# EAGLE schematic AncientFilter (EAGLE 7.7.0)

## Sheet 1 of 2
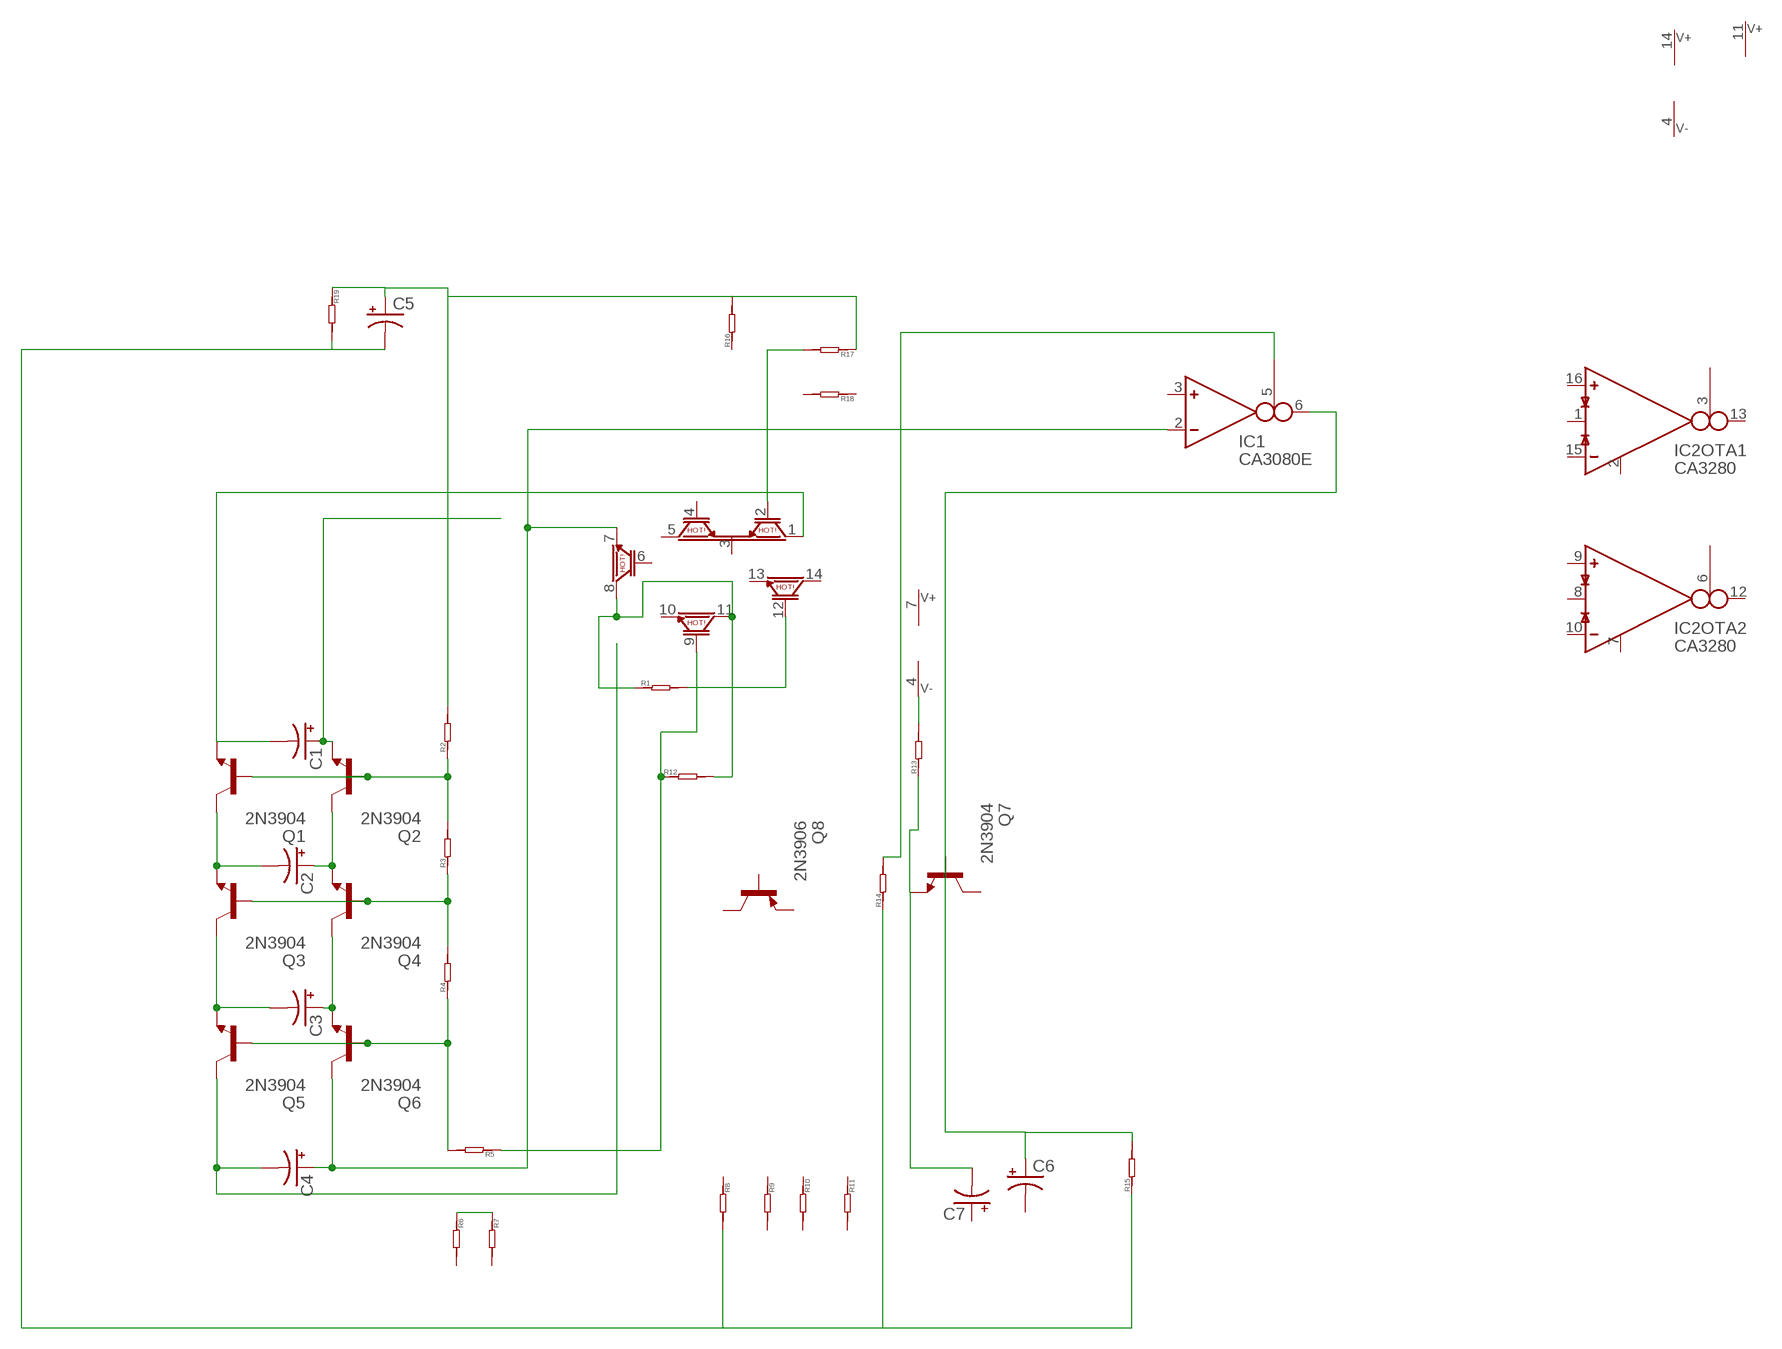
[diagram p0: schematic, sheet 1]

### Parts
C1  CPOL-USB45181A  [B45181A]
C2  CPOL-USB45181A  [B45181A]
C3  CPOL-USB45181A  [B45181A]
C4  CPOL-USB45181A  [B45181A]
C5  CPOL-USB45181A  [B45181A]
C6  CPOL-USB45181A  [B45181A]
C7  CPOL-USB45181A  [B45181A]
IC1  CA3080E  [DIL08]
IC2  CA3280  [SO16]
Q1  2N3904  [TO92]
Q2  2N3904  [TO92]
Q3  2N3904  [TO92]
Q4  2N3904  [TO92]
Q5  2N3904  [TO92]
Q6  2N3904  [TO92]
Q7  2N3904  [TO92]
Q8  2N3906  [TO92]
R1  R-0603  [R0603]
R2  R-0603  [R0603]
R3  R-0603  [R0603]
R4  R-0603  [R0603]
R5  R-0603  [R0603]
R6  R-0603  [R0603]
R7  R-0603  [R0603]
R8  R-0603  [R0603]
R9  R-0603  [R0603]
R10  R-0603  [R0603]
R11  R-0603  [R0603]
R12  R-0603  [R0603]
R13  R-0603  [R0603]
R14  R-0603  [R0603]
R15  R-0603  [R0603]
R16  R-0603  [R0603]
R17  R-0603  [R0603]
R18  R-0603  [R0603]
R19  R-0603  [R0603]
U$1  LM3046  [SO14]

### Nets
N$2: Q1.2(B) Q2.2(B) R2.1 R3.2
N$3: C1.+ Q2.3(E)
N$4: Q3.2(B) Q4.2(B) R3.1 R4.2
N$5: Q5.2(B) Q6.2(B) R4.1 R5.2
N$6: C1.- Q1.3(E) U$1.1(C2)
N$7: R6.1 R7.1
N$8: C2.- Q1.1(C) Q3.3(E)
N$9: C3.- Q3.1(C) Q5.3(E)
N$10: C2.+ Q2.1(C) Q4.3(E)
N$11: C3.+ Q4.1(C) Q6.3(E)
N$12: C4.- Q5.1(C)
N$13: C4.+ IC1.2(IN_N) Q6.1(C) U$1.7(E)
N$14: R5.1 R12.1 U$1.9(B)
N$15: R17.2 U$1.2(B2)
N$16: R1.2 U$1.12(B)
N$18: C5.+ R2.2 R16.2 R17.1 R19.1
N$19: C5.- R8.2 R14.1 R15.1 R19.2
N$20: IC1.5(I_BIAS) R14.2
N$21: C6.+ IC1.6(OUT) Q7.2(B) R15.2
N$22: C7.- Q7.3(E) R13.1
N$23: IC1.4(V-) R13.2
N$24: R1.1 R12.2 U$1.8(C) U$1.11(C)
Unconnected: C6.- C7.+ IC1.3(IN_P) IC1.7(V+) IC2.1(OTA1:I_DIODE) IC2.2(OTA1:NODE_X) IC2.3(OTA1:I_BIAS) IC2.4(SUPPLY1:V-) IC2.6(OTA2:I_BIAS) IC2.7(OTA2:NODE_X) IC2.8(OTA2:I_DIODE) IC2.9(OTA2:IN_P) IC2.10(OTA2:IN_N) IC2.11(SUPPLY2:V+) IC2.12(OTA2:OUT) IC2.13(OTA1:OUT) IC2.14(SUPPLY1:V+) IC2.15(OTA1:IN_N) IC2.16(OTA1:IN_P) Q7.1(C) Q8.1(C) Q8.2(B) Q8.3(E) R6.2 R7.2 R8.1 R9.1 R9.2 R10.1 R10.2 R11.1 R11.2 R16.1 R18.1 R18.2 U$1.3(E) U$1.4(B1) U$1.5(C1) U$1.6(B) U$1.10(E) U$1.13(E) U$1.14(C)

## Sheet 2 of 2
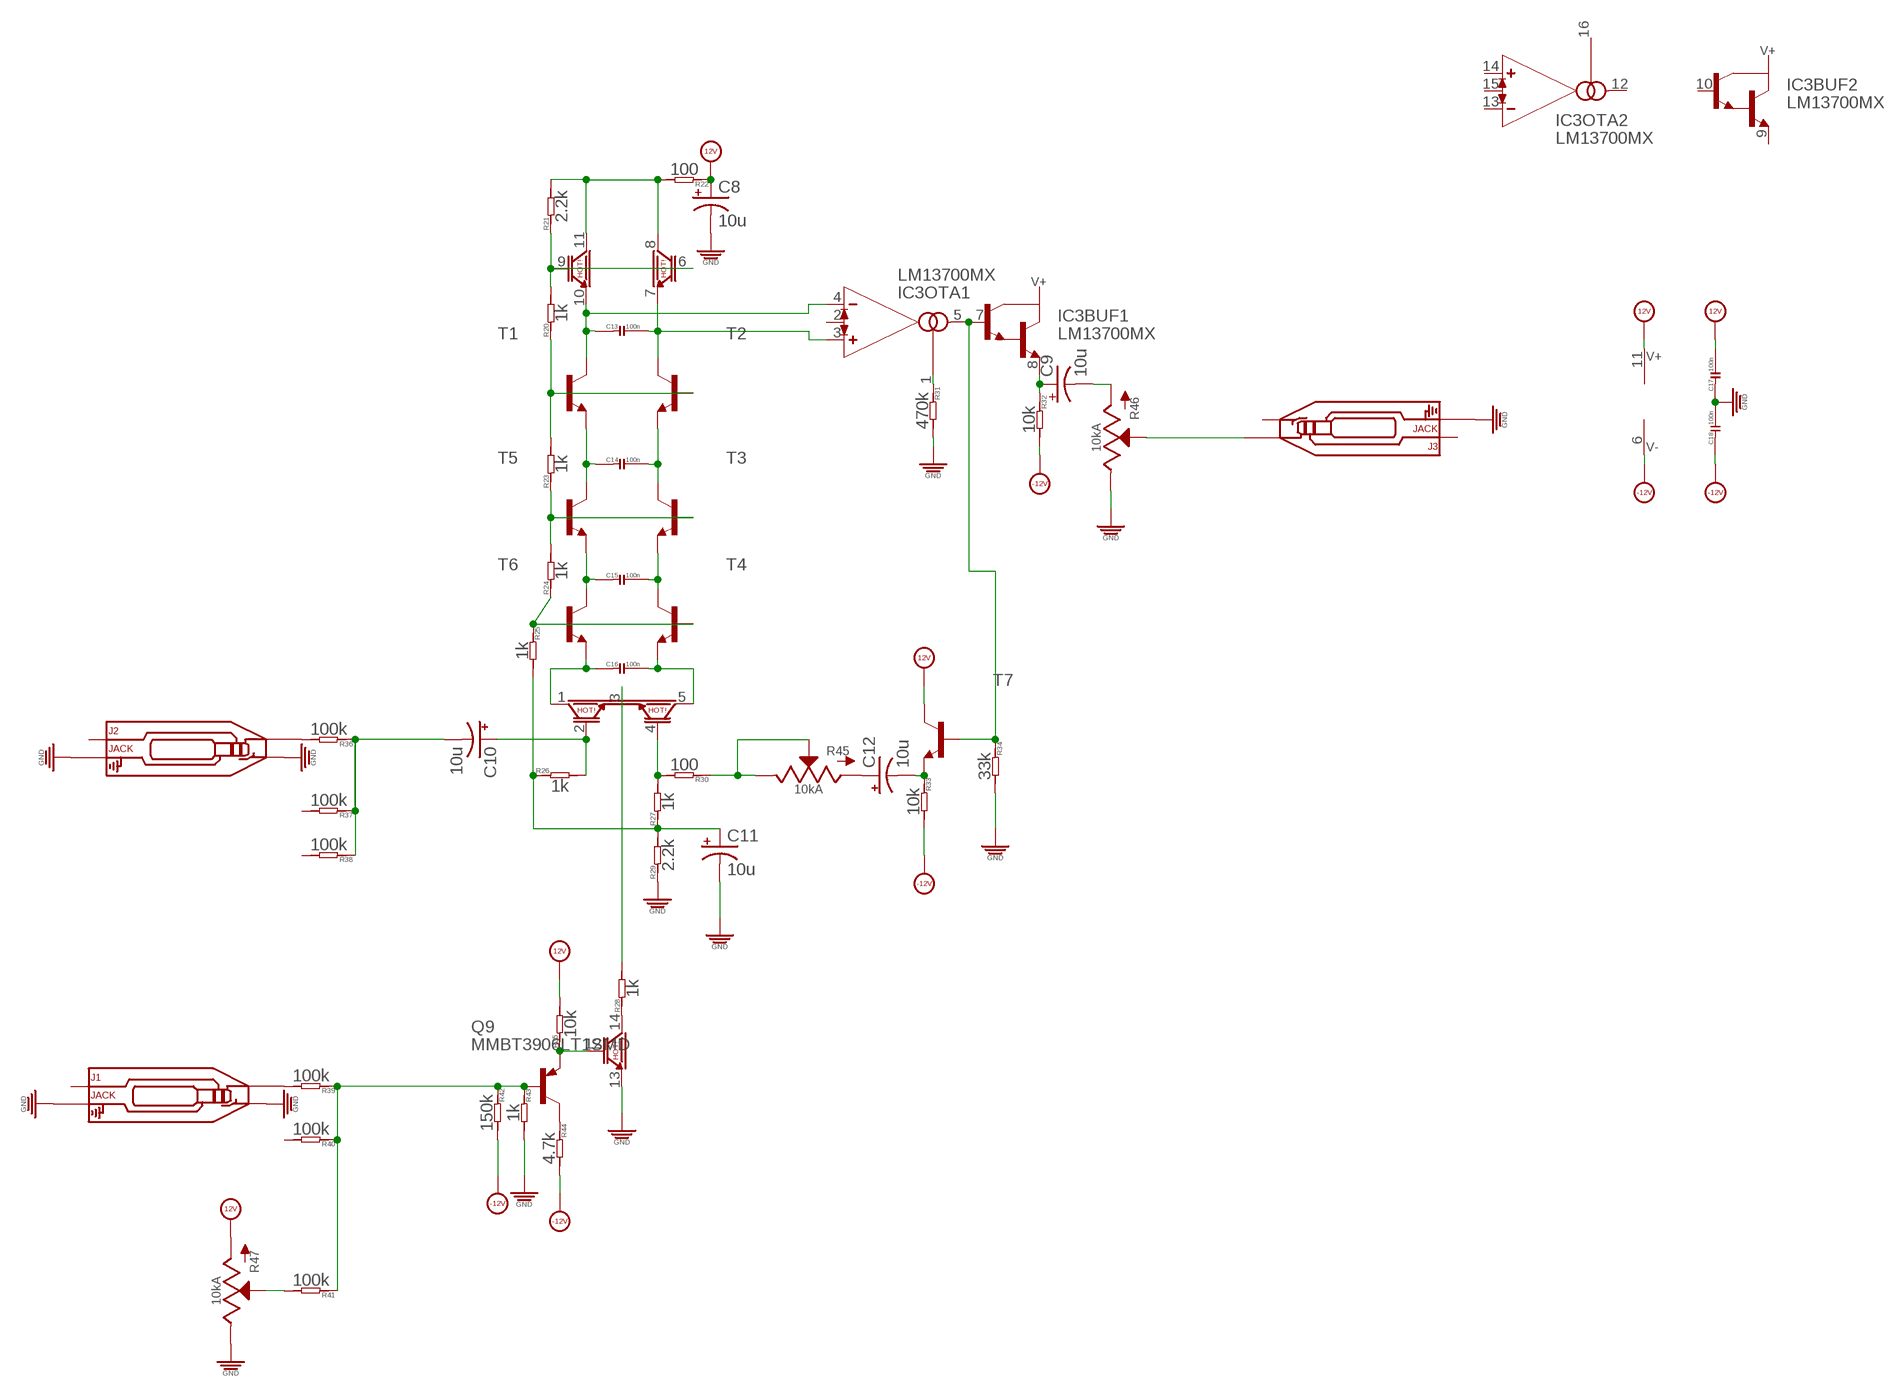
[diagram p1: schematic, sheet 2]

### Parts
C8  10u  CPOL-US153CLV-0605  [153CLV-0605]
C9  10u  CPOL-US153CLV-0605  [153CLV-0605]
C10  10u  CPOL-US153CLV-0605  [153CLV-0605]
C11  10u  CPOL-US153CLV-0605  [153CLV-0605]
C12  10u  CPOL-US153CLV-0605  [153CLV-0605]
C13  100n  C-0603  [C0603]
C14  100n  C-0603  [C0603]
C15  100n  C-0603  [C0603]
C16  100n  C-0603  [C0603]
C17  100n  C-0603  [C0603]
C18  100n  C-0603  [C0603]
IC3  LM13700MX  [SO16]
J1  JACK  AUDIO-JACK_SMALLSYMBOLNODRILL  [3.5MM-JACK-SWITCH-13MM-NOHOLES]
J2  JACK  AUDIO-JACK_SMALLSYMBOLNODRILL  [3.5MM-JACK-SWITCH-13MM-NOHOLES]
J3  JACK  AUDIO-JACK_SMALLSYMBOLNODRILL  [3.5MM-JACK-SWITCH-13MM-NOHOLES]
Q9  MMBT3906LT1SMD  [SOT23-BEC]
R20  1k  R-0603  [R0603]
R21  2.2k  R-0603  [R0603]
R22  100  R-0603  [R0603]
R23  1k  R-0603  [R0603]
R24  1k  R-0603  [R0603]
R25  1k  R-0603  [R0603]
R26  1k  R-0603  [R0603]
R27  1k  R-0603  [R0603]
R28  1k  R-0603  [R0603]
R29  2.2k  R-0603  [R0603]
R30  100  R-0603  [R0603]
R31  470k  R-0603  [R0603]
R32  10k  R-0603  [R0603]
R33  10k  R-0603  [R0603]
R34  33k  R-0603  [R0603]
R35  10k  R-0603  [R0603]
R36  100k  R-0603  [R0603]
R37  100k  R-0603  [R0603]
R38  100k  R-0603  [R0603]
R39  100k  R-0603  [R0603]
R40  100k  R-0603  [R0603]
R41  100k  R-0603  [R0603]
R42  150k  R-0603  [R0603]
R43  1k  R-0603  [R0603]
R44  4.7k  R-0603  [R0603]
R45  10kA  POTSQUAREHOLE_SMALLKNOB  [ALPS_POT_SQUAREHOLES]
R46  10kA  POTSQUAREHOLE_SMALLKNOB  [ALPS_POT_SQUAREHOLES]
R47  10kA  POTSQUAREHOLE_SMALLKNOB  [ALPS_POT_SQUAREHOLES]
T1  MMBT3904LT1-NPN-SOT23-BEC  [SOT23-BEC]
T2  MMBT3904LT1-NPN-SOT23-BEC  [SOT23-BEC]
T3  MMBT3904LT1-NPN-SOT23-BEC  [SOT23-BEC]
T4  MMBT3904LT1-NPN-SOT23-BEC  [SOT23-BEC]
T5  MMBT3904LT1-NPN-SOT23-BEC  [SOT23-BEC]
T6  MMBT3904LT1-NPN-SOT23-BEC  [SOT23-BEC]
T7  MMBT3904LT1-NPN-SOT23-BEC  [SOT23-BEC]
U$2  LM3046  [SO14]

### Nets
12V: C8.+ C17.2 IC3.11(SUPPLY:V+) R22.1 R35.2 R47.P$3(A) T7.C
-12V: C18.1 IC3.6(SUPPLY:V-) R32.2 R33.2 R42.2 R44.2
GND: C8.- C11.- C17.1 C18.2 J1.RING_B@1(RING) J1.RING_T@3(RING) J1.SWITCH_B@1(SWITCH) J1.SWITCH_T@3(SWITCH) J2.RING_B@1(RING) J2.RING_T@3(RING) J2.SWITCH_B@1(SWITCH) J2.SWITCH_T@3(SWITCH) J3.RING_B@1(RING) J3.RING_T@3(RING) R29.1 R31.2 R34.2 R43.2 R46.P$1(E) R47.P$1(E) U$2.13(E)
N$1: Q9.E R35.1 U$2.12(B)
N$17: C12.- R33.1 T7.E
N$26: R41.2 R47.P$2(S)
N$27: R20.2 R21.1 U$2.6(B) U$2.9(B)
N$28: C13.1 IC3.4(OTA1:IN_N) T1.C U$2.10(E)
N$29: C13.2 IC3.3(OTA1:IN_P) T2.C U$2.7(E)
N$30: C14.1 T1.E T5.C
N$31: C14.2 T2.E T3.C
N$32: C15.1 T5.E T6.C
N$33: C15.2 T3.E T4.C
N$34: C16.2 T4.E U$2.5(C1)
N$35: C16.1 T6.E U$2.1(C2)
N$36: R20.1 R23.2 T1.B T2.B
N$37: R23.1 R24.2 T3.B T5.B
N$38: R24.1 R25.1 T4.B T6.B
N$39: C10.+ R26.2 U$2.2(B2)
N$40: R28.2 U$2.3(E)
N$41: R28.1 U$2.14(C)
N$42: Q9.C R44.1
N$43: Q9.B R39.1 R40.1 R41.1 R42.1 R43.1
N$44: C10.- R36.1 R37.1 R38.1
N$45: C11.+ R25.2 R26.1 R27.1 R29.2
N$46: R27.2 R30.2 U$2.4(B1)
N$47: R21.2 R22.2 U$2.8(C) U$2.11(C)
N$49: IC3.1(OTA1:I_BIAS) R31.1
N$50: C9.- R46.P$3(A)
N$51: IC3.5(OTA1:OUT) IC3.7(BUF1:B) R34.1 T7.B
N$52: C9.+ IC3.8(BUF1:E) R32.1
N$53: J3.TIP_B@1(TIP) J3.TIP_T@3(TIP) R46.P$2(S)
N$54: R30.1 R45.P$1(E) R45.P$2(S)
N$55: C12.+ R45.P$3(A)
N$56: J1.TIP_B@1(TIP) J1.TIP_T@3(TIP) R39.2
N$57: J2.TIP_B@1(TIP) J2.TIP_T@3(TIP) R36.2
Unconnected: IC3.2(OTA1:I_DIODE) IC3.9(BUF2:E) IC3.10(BUF2:B) IC3.12(OTA2:OUT) IC3.13(OTA2:IN_N) IC3.14(OTA2:IN_P) IC3.15(OTA2:I_DIODE) IC3.16(OTA2:I_BIAS) J1.SECOND_B@1(SECOND) J1.SECOND_T@3(SECOND) J2.SECOND_B@1(SECOND) J2.SECOND_T@3(SECOND) J3.SECOND_B@1(SECOND) J3.SECOND_T@3(SECOND) J3.SWITCH_B@1(SWITCH) J3.SWITCH_T@3(SWITCH) R37.2 R38.2 R40.2

## Library data of the parts
C1-C12 = adafruit:CPOL-US: POLARIZED CAPACITOR, American symbol
C13-C18 = OPL:C*
IC1 = ota:CA3080: OTA
IC2 = ota:CA3280: Dual OTA
IC3 = ota:LM13700: Dual OTA with buffers
J1-J3 = EurorackModularParts:AUDIO-JACK_SMALLSYMBOL: Switching Mono 3.5mm Audio Jack from Erthenvar.
Q1-Q7 = transistor-npn:2N3904: NPN Transistor
Q8 = transistor-pnp:2N3906: PNP Transistor
Q9 = transistor-pnp:MMBT3906*: PNP Transistror
R1-R44 = OPL:R*
R45 = EurorackModularParts:POT; DESC: Resonance
R46 = EurorackModularParts:POT; DESC: Volume
R47 = EurorackModularParts:POT; DESC: Cutoff
T1-T7 = transistor:*-NPN-: NPN Transistror BF959 corrected 2008.03.06
U$1 U$2 = FenixBase:LM3046